# Altium project LM-008.PrjPcb
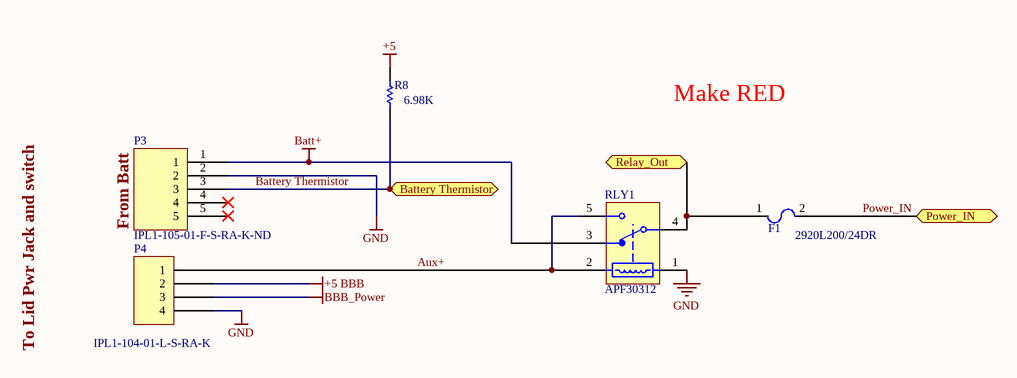
[diagram p0: Power_Input.SchDoc]
3 sheets, 43 parts. Net scope: flat (ports and power ports of the same name join across sheets).
Board file: LM-008.PcbDoc
Sheets:
  Power_Input.SchDoc
  36V_Supply.SchDoc
  LM-008.SchDoc

## Sheet Power_Input.SchDoc: Power Input
size OrCAD A; DocumentNumber: LM-008; Revision: A; SheetNumber: 1; SheetTotal: 2; DocumentName: LM-008

### Parts
F1  PCT  [CAPC7451X12N]  (value not drawn)
P3  Supplier Part Number 1: IPL1-105-01-F-S-RA-K-ND  [IPL1-105-01-F-S-RA]  (hidden comment: IPL1-105-01-F-S-RA)
P4  IPL1-104-01-L-S-RA-K  [IPL1-104-01-L-S-RA-K]
R8  6.98K  [RESC0402(1005)_L]
RLY1  APF30312  [PNSC-PF-5-2800x500x1500_V]

### Ports
Battery Thermistor, Power_IN, Relay_Out

### Nets
+5: R8.2
+5 BBB: P4.2
Batt+: P3.1 RLY1.3(NC)
BBB_Power: P4.3
GND: P3.2 P4.4 RLY1.1
Aux+: P4.1 RLY1.2 RLY1.5(NO)
Battery Thermistor: P3.3 R8.1 ; port Battery Thermistor
Power_IN: F1.2 ; port Power_IN
NetF1_1: F1.1 RLY1.4(COM) ; port Relay_Out

Not connected (* = marked no-connect by the designer): P3 4* 5*

### Notes on the sheet
- Make RED
- From Batt
- (near F1) 2920L200/24DR
- To Lid Pwr Jack and switch
- Title
- Size:
- Date:
- Orcad A
- Number:
- Time:
- Revision:
- Sheet
- of
- ZLS Corporation
- 7801 North Lamar Blvd.
- Suite E-184
- Austin, Texas 78752  USA
- (512) 453-0288
- File:

### Library data of the parts
P4 = IPL1-104-01-L-S-RA-K: Manufacturer: Samtec Inc.; Connector Type: Header; Pitch - Mating: 0.100" (2.54mm); Number of Positions: 4; Number of Positions Loaded: All; Style: Board to Cable/Wire; Shrouding: Shrouded - 4 Wall; Contact Length - Mating: 0.215" (5.46mm); Contact Length - Post: 0.085" (2.16mm); Material Flammability Rating: UL94 V-0; Voltage Rating: 675VAC, 954VDC; Supplier 1: Digi-Key; Supplier Part Number 1: SAM9597-ND; Manufacturer Part Number: IPL1-104-01-L-S-RA-K; RoHS: RoHS Compliant; Category: Connectors, Interconnects; Stock 1: 265; Pricing 1: 1=2.53, 10=2.424, 100=2.02, 500=1.717, 1000=1.4645, 5000=1.313 (USD); Packaging: Tube; Part Status: Active; Contact Type: Male Pin; Number of Rows: 1; Row Spacing - Mating: -; Mounting Type: Through Hole, Right Angle; Termination: Solder; Fastening Type: Locking Ramp; Overall Contact Length: -; Insulation Height: 0.240" (6.10mm); Contact Shape: Square; Contact Finish - Mating: Gold; Contact Finish Thickness - Mating: 10µin (0.25µm); Contact Finish - Post: Tin; Contact Material: Phosphor Bronze; Insulation Material: Liquid Crystal Polymer (LCP); Features: -; Operating Temperature: -55°C ~ 125°C; Ingress Protection: -; Insulation Color: Natural; Current Rating: -; Mated Stacking Heights: -; Contact Finish Thickness - Post: -; Applications: -; ComponentLink1URL: http://suddendocs.samtec.com/prints/ipl1-1xx-xx-xxx-s-xx-x-xx-mkt.pdf; ComponentLink1Description: http://suddendocs.samtec.com/prints/ipl1-1xx-xx-xxx-s-xx-x-xx-mkt.pdf
R8 = CMP-1011-00927-1: RES SMD 6.98K OHM 1% 1/16W 0402; Manufacturer: Yageo; Manufacturer Part Number: RC0402FR-076K98L; Power (Watts): 0.063W, 1/16W; Temperature Coefficient: ±100ppm/°C; Supplier 1: Digi-Key; Supplier Part Number 1: YAG3220CT-ND; RoHS: RoHS Compliant; Category: Resistors; Stock 1: 182255; Pricing 1: 1=0.1, 10=0.014, 100=0.0055, 1000=0.00247, 2500=0.00214, 5000=0.00177 (USD); Packaging: Cut Tape (CT); Part Status: Active; Tolerance: ±1%; Composition: Thick Film; Features: Moisture Resistant; Operating Temperature: -55°C ~ 155°C; Package / Case: 0402 (1005 Metric); Supplier Device Package: 0402; Size / Dimension: 0.039" L x 0.020" W (1.00mm x 0.50mm); Height - Seated (Max): 0.016" (0.40mm); Failure Rate: -; ComponentLink1URL: http://www.yageo.com/documents/recent/PYu-RC_Group_51_RoHS_L_7.pdf; ComponentLink1Description: http://www.yageo.com/documents/recent/PYu-RC_Group_51_RoHS_L_7.pdf
RLY1 = CMP-1503-00270-1: PF Relays, 12 V Coil Voltage, 170 mW Nominal Operating Power, -40 to 85 degC, 5-Pin PF, Tube, Case, RoHS; Manufacturer: Panasonic; Max Switching Voltage: 250 V AC; Nominal Operating Power: 170 mW; Electrical Life: 5x10^4 (N.O.), 3x10^4 (N.C.); Max Switching Current: 6 A; Coil Voltage: 12 V; Mechanical Life(Min.operation): 5x10^6; Pb-Free: True; ComponentLink3Description: Package Specification; ComponentLink1Description: Manufacturer URL; RoHS: True; ComponentLink3URL: http://www3.panasonic.biz/ac/e_download/control/relay/power/catalog/mech_eng_pf.pdf?f_cd=300412; PackageReference: PF-5-2800x500x1500; ComponentLink1URL: http://www3.panasonic.biz/ac/ae/index.jsp; ComponentLink2Description: Datasheet; Series: PF Relays; PartNumber: APF30312; PackageDescription: 5-Pin Through Hole Terminal Package, Body 28 x 5 mm; Packing: Tube, Case; DatasheetVersion: 201402-T; Mounting Technology: Through Hole; PackageVersion: ASCTB205E, 02/2014; ComponentLink2URL: http://www3.panasonic.biz/ac/e_download/control/relay/power/catalog/mech_eng_pf.pdf?f_cd=300412
P3 = IPL1-105-01-F-S-RA: Supplier 1: Digi-Key

## Sheet 36V_Supply.SchDoc: 36V DC-DC Converter
size OrCAD A; DocumentNumber: LM-008; Revision: -; SheetNumber: 2; SheetTotal: 3; DocumentName: LM-008
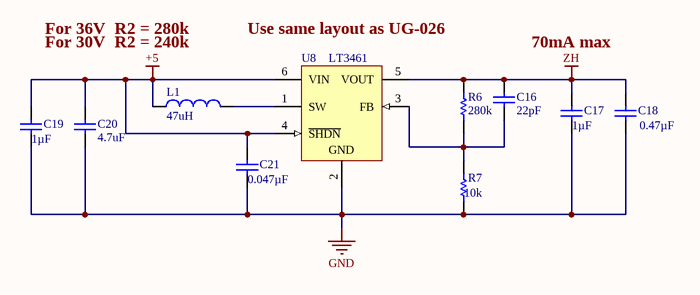
[diagram p1: 36V_Supply.SchDoc]

### Parts
C16  22pF  [CAPC1206(3216)170_L]
C17  Capacitance: 1µF  [CAPC1210(3225)100_N]  (hidden comment: CAP CER 1UF 50V X7R 1210)
C18  Capacitance: 0.47µF  [CAPC1206(3216)190_N]  (hidden comment: CAP CER 0.47UF 50V X7R 1206)
C19  Capacitance: 1µF  [CAPC0805(2012)145_N]  (hidden comment: CAP CER 1UF 16V X7R 0805)
C20  4.7uF  [CAPC0805(2012)145_M]
C21  Capacitance: 0.047µF  [CAPC0805(2012)145_N]  (hidden comment: CAP CER 0.047UF 16V X7R 0603)
L1  47uH  [C1210]
R6  Resistance (Ohms): 280k  [RESC0805(2012)_M]  (hidden comment: RES SMD 280K OHM 1% 1/8W 0805)
R7  Resistance (Ohms): 10k  [RESC0805(2012)_M]  (hidden comment: RES SMD 10K OHM 1% 1/8W 0805)
U8  LT3461  [LT-S6-6-TSOT-23_N]

### Nets
+5: C19.2 C20.2 C21.2 L1.1 U8.4(~{SHDN}) U8.6(VIN)
GND: C17.1 C18.1 C19.1 C20.1 C21.1 R7.2 U8.2(GND)
ZH: C16.2 C17.2 C18.2 R6.1 U8.5(VOUT)
NetC16_1: C16.1 R6.2 R7.1 U8.3(FB)
NetL1_2: L1.2 U8.1(SW)

### Notes on the sheet
- For 36V  R2 = 280k
- For 30V  R2 = 240k
- Use same layout as UG-026
- 70mA max
- Title
- Size:
- Date:
- Orcad A
- Number:
- Time:
- Revision:
- Sheet
- of
- ZLS Corporation
- 7801 North Lamar Blvd.
- Suite E-184
- Austin, Texas 78752  USA
- (512) 453-0288
- File:

### Library data of the parts
C16 = CMP-1037-04573-1: CAP CER 22PF 50V C0G/NP0 1206; Manufacturer: KEMET; Manufacturer Part Number: C1206C220K5GACTU; Tolerance: ±10%; Temperature Coefficient: C0G, NP0; Supplier 1: Digi-Key; Supplier Part Number 1: 399-8165-1-ND; RoHS: RoHS Compliant; Category: Capacitors; Stock 1: 35613; Pricing 1: 1=0.18, 10=0.128, 100=0.06, 500=0.04208, 1000=0.03483 (USD); Packaging: Cut Tape (CT); Part Status: Active; Voltage - Rated: 50V; Operating Temperature: -55°C ~ 125°C; Features: Low ESL; Ratings: -; Applications: General Purpose; Failure Rate: -; Mounting Type: Surface Mount, MLCC; Package / Case: 1206 (3216 Metric); Size / Dimension: 0.126" L x 0.063" W (3.20mm x 1.60mm); Height - Seated (Max): -; Thickness (Max): 0.035" (0.88mm); Lead Spacing: -; Lead Style: -; ComponentLink1URL: http://www.kemet.com/docfinder?Partnumber=C1206C220K2GACTU; ComponentLink1Description: http://www.kemet.com/docfinder?Partnumber=C1206C220K2GACTU
C17 = CMP-1038-01123-1: Manufacturer: Taiyo Yuden; Manufacturer Part Number: UMK325B7105KH-T; Tolerance: ±10%; Supplier 1: Digi-Key; Supplier Part Number 1: 587-1366-1-ND; RoHS: RoHS Compliant; Category: Capacitors; Stock 1: 23864; Pricing 1: 1=0.36, 10=0.247, 100=0.1398, 500=0.0987, 1000=0.08637 (USD); Packaging: Cut Tape (CT); Part Status: Active; Voltage - Rated: 50V; Temperature Coefficient: X7R; Operating Temperature: -55°C ~ 125°C; Features: -; Ratings: -; Applications: General Purpose; Mounting Type: Surface Mount, MLCC; Package / Case: 1210 (3225 Metric); Size / Dimension: 0.126" L x 0.098" W (3.20mm x 2.50mm); Height - Seated (Max): -; Thickness (Max): 0.063" (1.60mm); Lead Spacing: -; Lead Style: -; ComponentLink1URL: http://www.yuden.co.jp/productdata/catalog/en/mlcc_all_e.pdf; ComponentLink1Description: http://www.yuden.co.jp/productdata/catalog/en/mlcc_all_e.pdf
C18 = CMP-1037-04570-1: Manufacturer: Taiyo Yuden; Manufacturer Part Number: UMK316B7474KL-T; Tolerance: ±10%; Supplier 1: Digi-Key; Supplier Part Number 1: 587-1325-1-ND; RoHS: RoHS Compliant; Category: Capacitors; Stock 1: 8658; Pricing 1: 1=0.3, 10=0.203, 100=0.115, 500=0.08114, 1000=0.071 (USD); Packaging: Cut Tape (CT); Part Status: Active; Voltage - Rated: 50V; Temperature Coefficient: X7R; Operating Temperature: -55°C ~ 125°C; Features: -; Ratings: -; Applications: General Purpose; Mounting Type: Surface Mount, MLCC; Package / Case: 1206 (3216 Metric); Size / Dimension: 0.126" L x 0.063" W (3.20mm x 1.60mm); Height - Seated (Max): -; Thickness (Max): 0.071" (1.80mm); Lead Spacing: -; Lead Style: -; ComponentLink1URL: http://www.yuden.co.jp/productdata/catalog/en/mlcc_all_e.pdf; ComponentLink1Description: http://www.yuden.co.jp/productdata/catalog/en/mlcc_all_e.pdf
C19 = CMP-1036-04795-1: Manufacturer: Taiyo Yuden; Manufacturer Part Number: EMK212B7105KG-T; Tolerance: ±10%; Supplier 1: Digi-Key; Supplier Part Number 1: 587-1283-1-ND; RoHS: RoHS Compliant; Category: Capacitors; Stock 1: 41495; Pricing 1: 1=0.13, 10=0.089, 100=0.042, 1000=0.02439 (USD); Packaging: Cut Tape (CT); Part Status: Active; Voltage - Rated: 16V; Temperature Coefficient: X7R; Operating Temperature: -55°C ~ 125°C; Features: -; Ratings: -; Applications: General Purpose; Mounting Type: Surface Mount, MLCC; Package / Case: 0805 (2012 Metric); Size / Dimension: 0.079" L x 0.049" W (2.00mm x 1.25mm); Height - Seated (Max): -; Thickness (Max): 0.053" (1.35mm); Lead Spacing: -; Lead Style: -; ComponentLink1URL: http://ds.yuden.co.jp/TYCOMPAS/ut/detail.do?productNo=EMK212B7105KG-T&fileName=EMK212B7105KG-T_SS&mode=specSheetDownload; ComponentLink1Description: http://ds.yuden.co.jp/TYCOMPAS/ut/detail.do?productNo=EMK212B7105KG-T&fileName=EMK212B7105KG-T_SS&mode=specSheetDownload
C20 = CMP-1036-04750-1: CAP CER 4.7UF 16V X7R 0805; Manufacturer: KEMET; Manufacturer Part Number: C0805C475K4RACTU; Tolerance: ±10%; Supplier 1: Digi-Key; Supplier Part Number 1: 399-7415-1-ND; RoHS: RoHS Compliant; Category: Capacitors; Stock 1: 88820; Pricing 1: 1=0.26, 10=0.176, 100=0.0894, 500=0.06118, 1000=0.05412 (USD); Packaging: Cut Tape (CT); Part Status: Active; Voltage - Rated: 16V; Temperature Coefficient: X7R; Operating Temperature: -55°C ~ 125°C; Features: Low ESL; Ratings: -; Applications: General Purpose; Failure Rate: -; Mounting Type: Surface Mount, MLCC; Package / Case: 0805 (2012 Metric); Size / Dimension: 0.079" L x 0.049" W (2.00mm x 1.25mm); Height - Seated (Max): -; Thickness (Max): 0.055" (1.40mm); Lead Spacing: -; Lead Style: -; ComponentLink1URL: http://www.kemet.com/docfinder?Partnumber=C0805C475K4RACTU; ComponentLink1Description: http://www.kemet.com/docfinder?Partnumber=C0805C475K4RACTU
C21 = CMP-1036-04795-1: Manufacturer: Murata Electronics North America; Manufacturer Part Number: GRM188R71C473KA01D; Tolerance: ±10%; Supplier 1: Digi-Key; Supplier Part Number 1: 490-1529-6-ND; RoHS: RoHS Compliant; Category: Capacitors; Stock 1: 26; Pricing 1: 1=0.1, 10=0.046, 100=0.0206, 500=0.0147, 1000=0.01155 (USD); Packaging: Digi-Reel®; Part Status: Active; Voltage - Rated: 16V; Temperature Coefficient: X7R; Operating Temperature: -55°C ~ 125°C; Features: -; Ratings: -; Applications: General Purpose; Mounting Type: Surface Mount, MLCC; Package / Case: 0603 (1608 Metric); Size / Dimension: 0.063" L x 0.031" W (1.60mm x 0.80mm); Height - Seated (Max): -; Thickness (Max): 0.035" (0.90mm); Lead Spacing: -; Lead Style: -; ComponentLink1URL: http://www.murata.com/~/media/webrenewal/support/library/catalog/products/capacitor/mlcc/c02e.ashx; ComponentLink1Description: http://www.murata.com/~/media/webrenewal/support/library/catalog/products/capacitor/mlcc/c02e.ashx
L1 = Inductor: FIXED IND 47UH 170MA 1.3 OHM SMD; Manufacturer: Murata Electronics North America; Manufacturer Part Number: LQH32CN470K23L; Type: Wirewound; Material - Core: Ferrite; Tolerance: ±10%; Shielding: Unshielded; DC Resistance (DCR): 1.69 Ohm Max; Supplier 1: Digi-Key; Supplier Part Number 1: 490-2497-1-ND; RoHS: RoHS Compliant; Category: Inductors, Coils, Chokes; Stock 1: 1058; Pricing 1: 1=0.33, 10=0.297, 100=0.2043, 500=0.17458, 1000=0.13372 (USD); Packaging: Cut Tape (CT); Part Status: Active; Q @ Freq: -; Ratings: -; Operating Temperature: -40°C ~ 85°C; Mounting Type: Surface Mount; Package / Case: Nonstandard; Supplier Device Package: 1210; Size / Dimension: 0.126" L x 0.098" W (3.20mm x 2.50mm); Height - Seated (Max): 0.067" (1.70mm); ComponentLink1URL: http://search.murata.co.jp/Ceramy/image/img/P02/JELF243A-0039.pdf; ComponentLink1Description: http://search.murata.co.jp/Ceramy/image/img/P02/JELF243A-0039.pdf
R6 = CMP-1013-00017-1: Manufacturer: Vishay Dale; Manufacturer Part Number: CRCW0805280KFKEA; Power (Watts): 0.125W, 1/8W; Temperature Coefficient: ±100ppm/°C; Supplier 1: Digi-Key; Supplier Part Number 1: 541-280KCTR-ND; RoHS: RoHS Compliant; Category: Resistors; Stock 1: 10000; Pricing 1: 5000=0.00546, 10000=0.00474, 25000=0.00417, 50000=0.00382, 125000=0.00375 (USD); Packaging: Tape & Reel (TR); Part Status: Active; Tolerance: ±1%; Composition: Thick Film; Features: Automotive AEC-Q200; Operating Temperature: -55°C ~ 155°C; Package / Case: 0805 (2012 Metric); Supplier Device Package: 0805; Size / Dimension: 0.079" L x 0.049" W (2.00mm x 1.25mm); Height - Seated (Max): 0.020" (0.50mm); Failure Rate: -; ComponentLink1URL: http://www.vishay.com/docs/20035/dcrcwe3.pdf; ComponentLink1Description: http://www.vishay.com/docs/20035/dcrcwe3.pdf
R7 = CMP-1013-00017-1: Manufacturer: Yageo; Manufacturer Part Number: RC0805FR-0710KL; Power (Watts): 0.125W, 1/8W; Temperature Coefficient: ±100ppm/°C; Supplier 1: Digi-Key; Supplier Part Number 1: 311-10.0KCRCT-ND; RoHS: RoHS Compliant; Category: Resistors; Stock 1: 13336570; Pricing 1: 1=0.1, 10=0.022, 100=0.0088, 1000=0.00396, 2500=0.00344 (USD); Packaging: Cut Tape (CT); Part Status: Active; Tolerance: ±1%; Composition: Thick Film; Features: Moisture Resistant; Operating Temperature: -55°C ~ 155°C; Package / Case: 0805 (2012 Metric); Supplier Device Package: 0805; Size / Dimension: 0.079" L x 0.049" W (2.00mm x 1.25mm); Height - Seated (Max): 0.024" (0.60mm); Failure Rate: -; ComponentLink1URL: http://www.yageo.com/documents/recent/PYu-RC_Group_51_RoHS_L_7.pdf; ComponentLink1Description: http://www.yageo.com/documents/recent/PYu-RC_Group_51_RoHS_L_7.pdf
U8 = CMP-0491-01698-1: IC REG BOOST ADJ 0.3A TSOT23-6; Manufacturer 1: Linear Technology; Manufacturer Part Number 1: LT3461AES6#TRMPBF; Category 1: Integrated Circuits (ICs); Function: Step-Up; Output Configuration: Positive; Output Type: Adjustable; Number of Outputs: 1; Voltage - Input (Min): 2.5V; Voltage - Input (Max): 16V; Voltage - Output (Min/Fixed): 1.255V; Voltage - Output (Max): 38V; Current - Output: 300mA (Switch); Frequency - Switching: 3MHz; Synchronous Rectifier: No; Supplier 1: Digi-Key; Supplier Part Number 1: LT3461AES6#TRMPBFCT-ND; RoHS 1: RoHS Compliant; Description 1: IC REG BOOST ADJ 0.3A TSOT23-6; Stock 1: 1325; Pricing 1: 1=3.94, 25=3.52, 100=2.4, 250=2.2 (USD); Packaging: Cut Tape (CT); Part Status: Active; Topology: Boost; Operating Temperature: 0°C ~ 70°C (TA); Mounting Type: Surface Mount; Package / Case: SOT-23-6 Thin, TSOT-23-6; Supplier Device Package: TSOT-23-6; ComponentLink1URL: http://www.linear.com/docs/3469; ComponentLink1Description: http://www.linear.com/docs/3469

## Sheet LM-008.SchDoc: Main
size Tabloid; DocumentNumber: LM-008; SheetNumber: 3; SheetTotal: 3; DocumentName: LM-008
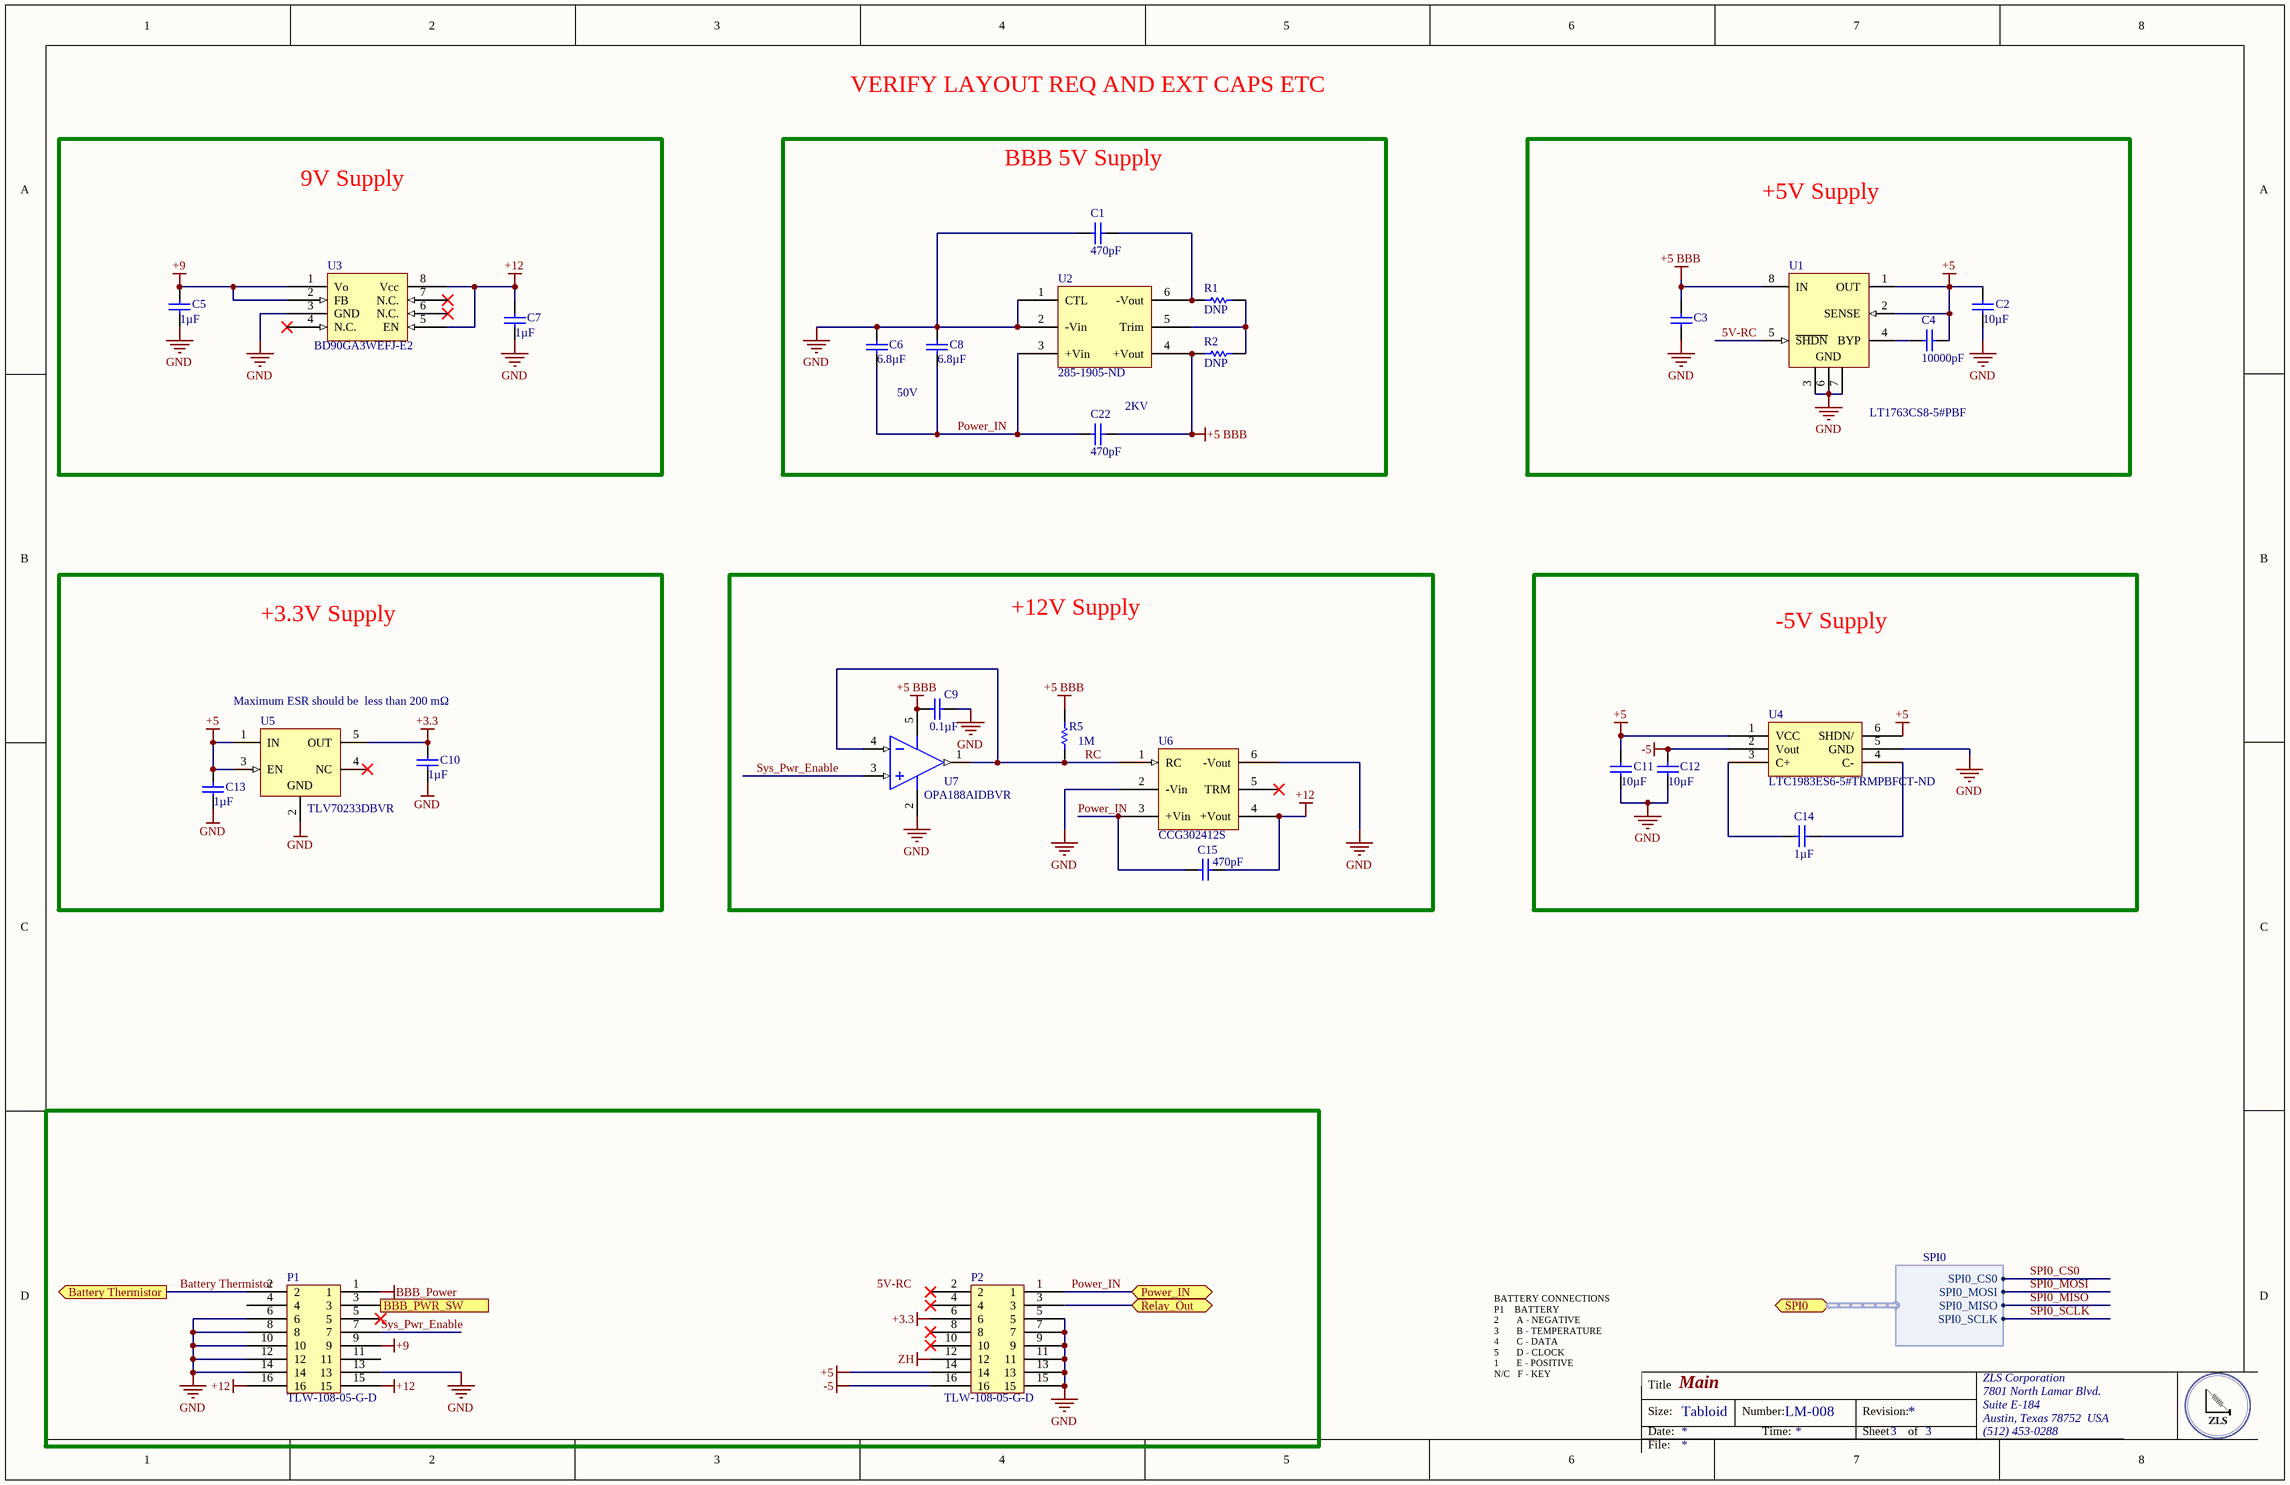
[diagram p2: LM-008.SchDoc]

### Parts
C1  Capacitance: 470pF  [CAPC1206(3216)130_N]  (hidden comment: CAP CER 1UF 50V X7R 1210)
C2  Capacitance: 10µF  [CAPC1206(3216)130_N]  (hidden comment: CAP CER 1UF 50V X7R 1210)
C3  1uF  [CAPC1206(3216)130_N]  (value not drawn)
C4  Capacitance: 10000pF  [CAPC1206(3216)130_N]  (hidden comment: CAP CER 1UF 50V X7R 1210)
C5  Capacitance: 1µF  [CAPC1206(3216)130_N]  (hidden comment: CAP CER 1UF 50V X7R 1210)
C6  Capacitance: 6.8µF  [CAPC1206(3216)130_N]  (hidden comment: CAP CER 1UF 50V X7R 1210)
C7  Capacitance: 1µF  [CAPC1206(3216)130_N]  (hidden comment: CAP CER 1UF 50V X7R 1210)
C8  Capacitance: 6.8µF  [CAPC1206(3216)130_N]  (hidden comment: CAP CER 1UF 50V X7R 1210)
C9  Capacitance: 0.1µF  [CAPC0805(2012)145_N]  (hidden comment: CAP CER 0.1UF 16V X7R 0805)
C10  Capacitance: 1µF  [CAPC1206(3216)130_N]  (hidden comment: CAP CER 1UF 50V X7R 1210)
C11  Capacitance: 10µF  [CAPC1206(3216)130_N]  (hidden comment: CAP CER 1UF 50V X7R 1210)
C12  Capacitance: 10µF  [CAPC1206(3216)130_N]  (hidden comment: CAP CER 1UF 50V X7R 1210)
C13  Capacitance: 1µF  [CAPC1206(3216)130_N]  (hidden comment: CAP CER 1UF 50V X7R 1210)
C14  Capacitance: 1µF  [CAPC1206(3216)130_N]  (hidden comment: CAP CER 1UF 50V X7R 1210)
C15  Capacitance: 470pF  [CAPC1812(4532)230_M]  (hidden comment: CAP CER 470PF 3KV X7R 1812)
C22  Capacitance: 470pF  [CAPC1206(3216)130_N]  (hidden comment: CAP CER 1UF 50V X7R 1210)
P1  TLW-108-05-G-D  [TLW-108-05-G-D]
P2  TLW-108-05-G-D  [TLW-108-05-G-D]
R1  DNP  [RESC0402(1005)_L]
R2  DNP  [RESC0402(1005)_L]
R5  1M  [RESC0402(1005)_L]
U1  LT1763CS8-5#PBF  [LT-S8-8_M]
U2  Supplier Part Number 1: 285-1905-ND  [PXB15-24WS05/NT]  (hidden comment: PXB15-24WS05/NT)
U3  BD90GA3WEFJ-E2  [TSOP127P600X100-8N]
U4  Supplier Part Number 1: LTC1983ES6-5#TRMPBFCT-ND  [SOT95P323X100-6N]  (hidden comment: LTC1983ES6-5#TRMPBF)
U5  TLV70233DBVR  [DBV0005A_N]
U6  CCG302412S  [CCG30]
U7  OPA188AIDBVR  [DBV0005A_M]

### Blocks framed on the sheet
9V Supply: C5 C7 U3
BBB 5V Supply: C1 C6 C8 C22 R1 R2 U2
+5V Supply: C2-C4 U1
+3.3V Supply: C10 C13 U5
+12V Supply: C9 C15 R5 U6 U7
-5V Supply: C11 C12 C14 U4

### Ports
Battery Thermistor (out), BBB_PWR_SW, Power_IN, Relay_Out, SPI0 (harness SPI0)

### Harnesses
SPI0: SPI0_CS0, SPI0_MOSI, SPI0_MISO, SPI0_SCLK

### Nets
+3.3: C10.2 P2.6 U5.5(OUT)
+5: C2.2 C4.1 C11.2 C13.2 P2.14 U1.1(OUT) U1.2(SENSE) U4.1(VCC) U4.6(SHDN/) U5.1(IN) U5.3(EN)
+5 BBB: C3.2 C9.1 C22.1 R2.2 R5.2 U1.8(IN) U2.4(+Vout) U7.5(V+)
+9: C5.2 P1.9 U3.1(Vo) U3.2(FB)
+12: C7.2 C15.2 P1.15 P1.16 U3.5(EN) U3.8(Vcc) U6.4(+Vout)
-5: C12.2 P2.16 U4.2(Vout)
BBB_Power: P1.1
GND: C1.2 C2.1 C3.1 C5.1 C6.2 C7.1 C8.2 C9.2 C10.1 C11.1 C12.1 C13.1 P1.6 P1.8 P1.10 P1.12 P1.13 P1.14 P2.5 P2.7 P2.9 P2.11 P2.13 P2.15 U1.3(GND) U1.6(GND) U1.7(GND) U2.1(CTL) U2.2(-Vin) U3.3(GND) U4.5(GND) U5.2(GND) U6.2(-Vin) U6.6(-Vout) U7.2(V-)
ZH: P2.12
5V-RC: U1.5(~{SHDN})
Battery Thermistor: P1.2 ; port Battery Thermistor
Power_IN: C6.1 C8.1 C15.1 C22.2 P2.1 U2.3(+Vin) U6.3(+Vin) ; port Power_IN
RC: R5.1 U6.1(RC) U7.1(OUT) U7.4(IN-)
SPI0_CS0: port SPI0.SPI0_CS0
SPI0_MISO: port SPI0.SPI0_MISO
SPI0_MOSI: port SPI0.SPI0_MOSI
SPI0_SCLK: port SPI0.SPI0_SCLK
Sys_Pwr_Enable: P1.7 U7.3(IN+)
NetC1_1: C1.1 R1.2 U2.6(-Vout)
NetC4_2: C4.2 U1.4(BYP)
NetC14_1: C14.1 U4.4(C-)
NetC14_2: C14.2 U4.3(C+)
NetF1_1: P2.3 ; port Relay_Out
NetP1_3: P1.3 ; port BBB_PWR_SW
NetR1_1: R1.1 R2.1 U2.5(Trim)

Not connected (* = marked no-connect by the designer): P1 4 5* 11; P2 2* 4* 8* 10*; U3 4(N.C.)* 6(N.C.)* 7(N.C.)*; U5 4(NC)*; U6 5(TRM)*

### Notes on the sheet
- VERIFY LAYOUT REQ AND EXT CAPS ETC
- 50V
- (near C22) 2KV
- Maximum ESR should be  less than 200 mΩ
- BATTERY CONNECTIONS
  P1    BATTERY
  2       A - NEGATIVE
  3       B - TEMPERATURE
  4       C - DATA
  5       D - CLOCK
  1       E - POSITIVE
  N/C   F - KEY
- Labels drawn without touching a wire or pin: 5V-RC
- Title
- Size:
- Date:
- Tabloid
- Number:
- Time:
- Revision:
- Sheet
- of
- ZLS Corporation
- 7801 North Lamar Blvd.
- Suite E-184
- Austin, Texas 78752  USA
- (512) 453-0288
- File:

### Library data of the parts
C1 C2 C4-C8 C10-C14 C22 = CMP-1037-04913-1: Manufacturer: Murata Electronics North America; Manufacturer Part Number: GRM32RR71H105KA01L; Tolerance: ±10%; Supplier 1: Digi-Key; Supplier Part Number 1: 490-1863-6-ND; RoHS: RoHS Compliant; Category: Capacitors; Stock 1: 66890; Pricing 1: 1=0.35, 10=0.242, 100=0.1449, 500=0.10868 (USD); Packaging: Digi-Reel®; Part Status: Active; Voltage - Rated: 50V; Temperature Coefficient: X7R; Operating Temperature: -55°C ~ 125°C; Features: -; Ratings: -; Applications: General Purpose; Mounting Type: Surface Mount, MLCC; Package / Case: 1210 (3225 Metric); Size / Dimension: 0.126" L x 0.098" W (3.20mm x 2.50mm); Height - Seated (Max): -; Thickness (Max): 0.079" (2.00mm); Lead Spacing: -; Lead Style: -; ComponentLink1URL: http://search.murata.co.jp/Ceramy/image/img/A01X/G101/ENG/GRM32RR71H105KA01-01.pdf; ComponentLink1Description: http://search.murata.co.jp/Ceramy/image/img/A01X/G101/ENG/GRM32RR71H105KA01-01.pdf
C3 = CMP-1037-04913-1
C9 = CMP-1036-04795-1: Manufacturer: Murata Electronics North America; Manufacturer Part Number: GRM219R71C104KA01D; Tolerance: ±10%; Voltage - Rated: 25V; Supplier Part Number 1: 490-1673-6-ND; Temperature Coefficient: X7R; Thickness (Max): 0.053" (1.35mm); Supplier 2: Digi-Key; Supplier Part Number 2: 490-1683-6-ND; RoHS: RoHS Compliant; Category: Capacitors; Stock 2: 245331; Pricing 2: 1=0.14, 10=0.098, 100=0.0462, 500=0.0324, 1000=0.02683 (USD); Packaging: Digi-Reel®; Part Status: Active; Operating Temperature: -55°C ~ 125°C; Features: -; Ratings: -; Applications: General Purpose; Mounting Type: Surface Mount, MLCC; Package / Case: 0805 (2012 Metric); Size / Dimension: 0.079" L x 0.049" W (2.00mm x 1.25mm); Height - Seated (Max): -; Lead Spacing: -; Lead Style: -; ComponentLink1URL: http://www.murata.com/~/media/webrenewal/support/library/catalog/products/capacitor/mlcc/c02e.ashx; ComponentLink1Description: http://www.murata.com/~/media/webrenewal/support/library/catalog/products/capacitor/mlcc/c02e.ashx
C15 = CMP-1040-00561-1: Manufacturer: Kemet; Manufacturer Part Number: C1812C471KHRACTU; Tolerance: 10%; Supplier 1: Digi-Key; Supplier Part Number 1: 399-7289-6-ND; Stock 1: 2705; Pricing 1: 1=0.88, 10=0.666, 100=0.4761 (USD); Case/Package: 1812; Case Code (Metric): 4532; Case Code (Imperial): 1812; Min Operating Temperature: -55°C; Max Operating Temperature: 125°C; Voltage Rating: 3kV; Packaging: Tape and Reel; Package Quantity: 1; Voltage Rating (DC): 3kV; Length: 0.177inch; Width: 0.126inch; Thickness: 0.071inch; Lead Free: Lead Free; ComponentLink1URL: http://www.kemet.com/docfinder?Partnumber=C1812C471KHRACTU; ComponentLink1Description: http://www.kemet.com/docfinder?Partnumber=C1812C471KHRACTU
P1 P2 = TLW-108-05-G-D: CONN HEADER .100" 16POS DL GOLD; Manufacturer: Samtec Inc.; Pitch - Mating: 0.100" (2.54mm); Number of Positions: 16; Number of Positions Loaded: All; Style: Board to Board or Cable; Shrouding: Unshrouded; Contact Length - Mating: 0.105" (2.67mm); Contact Length - Post: 0.170" (4.32mm); Overall Contact Length: 0.335" (8.51mm); Current Rating: 5.2A per Contact; Supplier 1: Digi-Key; Supplier Part Number 1: SAM1094-08-ND; Manufacturer Part Number: TLW-108-05-G-D; RoHS: RoHS Compliant; Category: Connectors, Interconnects; Stock 1: 0; Pricing 1: 1=4.48, 10=4.006, 100=3.2987, 500=2.60756, 1000=2.23842, 5000=2.04207, 10000=1.96353 (USD); Packaging: Bulk; Part Status: Active; Connector Type: Header; Contact Type: Male Pin; Number of Rows: 2; Row Spacing - Mating: 0.100" (2.54mm); Mounting Type: Through Hole; Termination: Solder; Fastening Type: Push-Pull; Insulation Height: 0.060" (1.52mm); Contact Shape: Square; Contact Finish - Mating: Gold; Contact Finish Thickness - Mating: 10µin (0.25µm); Contact Finish - Post: Gold; Contact Material: Phosphor Bronze; Insulation Material: Liquid Crystal Polymer (LCP); Features: -; Operating Temperature: -55°C ~ 125°C; Ingress Protection: -; Material Flammability Rating: -; Insulation Color: Black; Voltage Rating: -; Mated Stacking Heights: -; Contact Finish Thickness - Post: Flash; Applications: -; ComponentLink1URL: http://suddendocs.samtec.com/prints/tlw-mkt.pdf; ComponentLink1Description: http://suddendocs.samtec.com/prints/tlw-mkt.pdf
R1 R2 = CMP-1011-00927-1: TBD
R5 = CMP-1011-00927-1: Tolerance: ±1%; Temperature Coefficient: ±100ppm/°C; Supplier Part Number 1: YAG3220CT-ND; Supplier Device Package: 0402
U1 = CMP-0476-01685-1: 500 mA, Low Noise, LDO Micropower Regulator, 1.8 to 20 V Vin, 5 V Vout, 8-pin SOIC (S8-8), -40 to 125 degC, Pb-Free; Manufacturer: Linear Technology; Output Voltage: 5 V; Vin Min(V): 1.8; Discrete Pass Element: no; Number of Outputs: 1; Dropout Voltage(V): 0.3; Vin Max(V): 20; PSRR(dB): 65; Iout(mA): 500; Isupply(mA): 0.03; Mounting Technology: Surface Mount; ComponentLink3Description: Package Specification; PartNumber: LT1763CS8-5#PBF; PackageDescription: 8-Pin Plastic Small Outline (Narrow .150 Inch), Body 4.9 x 3.9 mm, Pitch 1.27 mm; DatasheetVersion: Rev. G; ComponentLink2URL: http://cds.linear.com/docs/en/datasheet/1763fg.pdf; PackageReference: S8-8; ComponentLink1URL: http://www.linear.com/; ComponentLink2Description: Datasheet; ComponentLink1Description: Manufacturer URL; PackageVersion: Rev. G, 03/2012; Shutdown Current(uA): 1; ComponentLink3URL: http://cds.linear.com/docs/en/packaging/05081610_G_SO8.pdf; RoHS: TRUE; Noise(uV): 20
U3 = BD90GA3WEFJ-E2: IC REG LDO 9V 0.3A 8HTSOP-J; Manufacturer: Rohm Semiconductor; Regulator Topology: Positive Fixed; Current - Output: 300mA; Voltage - Dropout (Typical): 0.6V @ 300mA; Voltage - Input: Up to 14V; Supplier 1: Digi-Key; Supplier Part Number 1: BD90GA3WEFJ-E2CT-ND; Manufacturer Part Number: BD90GA3WEFJ-E2; RoHS: RoHS Compliant; Category: Integrated Circuits (ICs); Stock 1: 4781; Pricing 1: 1=0.69, 10=0.606, 25=0.5364, 100=0.4672, 250=0.40664, 500=0.34608, 1000=0.27686 (USD); Packaging: Cut Tape (CT); Part Status: Active; Voltage - Output: 9V; Current - Limit (Min): -; Operating Temperature: -25°C ~ 85°C; Mounting Type: Surface Mount; Package / Case: 8-SOIC (0.154", 3.90mm Width) Exposed Pad; Supplier Device Package: 8-HTSOP-J; ComponentLink1URL: http://rohmfs.rohm.com/en/products/databook/datasheet/ic/power/linear_regulator/bdxxga3wefj-e.pdf; ComponentLink1Description: http://rohmfs.rohm.com/en/products/databook/datasheet/ic/power/linear_regulator/bdxxga3wefj-e.pdf
U4 = LTC1983ES6-5#TRMPBF: Manufacturer: Linear Technology/Analog Devices; Function: Step-Down; Output Configuration: Negative; Topology: Charge Pump; Output Type: Fixed; Number of Outputs: 1; Voltage - Input (Min): 2.3V; Voltage - Input (Max): 5.5V; Voltage - Output (Min/Fixed): -5V; Current - Output: 100mA; Frequency - Switching: 900kHz; Synchronous Rectifier: No; Supplier 1: Digi-Key; Manufacturer Part Number: LTC1983ES6-5#TRMPBF; RoHS: RoHS Compliant; Category: Integrated Circuits (ICs); Stock 1: 17516; Pricing 1: 1=4.36, 25=3.8952, 100=2.3256, 250=2.1318 (USD); Packaging: Cut Tape (CT); Part Status: Active; Voltage - Output (Max): -; Operating Temperature: -40°C ~ 85°C (TA); Mounting Type: Surface Mount; Package / Case: SOT-23-6 Thin, TSOT-23-6; Supplier Device Package: TSOT-23-6; Base Part Number: LTC1983-5; ComponentLink1URL: http://www.linear.com/docs/2135; ComponentLink1Description: http://www.linear.com/docs/2135
U5 = CMP-0394-00528-2: Single Output LDO, 300 mA, Fixed 3.3 V Output, 2 to 5.5 V Input, with Low IQ, 5-pin SOT-23 (DBV), -40 to 125 degC, Green (RoHS & no Sb/Br); Manufacturer: Texas Instruments; Vout Adj(Max)(V): 3.3; Vin(Max)(V): 5.5; SubFamily: Single Channel LDO; Iq(Typ)(mA): 0.03; Iout(Max)(A): 0.3; Vin(Min)(V): 2; Vdo(Typ)(mV): 220; Vout Adj(Min)(V): 3.3; Eco-Plan: Green (RoHS & no Sb/Br); PackageVersion: 4073253-4/K; ComponentLink1Description: Manufacturer URL; DatasheetVersion: SLVSAG6B; ComponentLink2Description: Datasheet; ComponentLink3URL: http://www.ti.com/litv/pdf/mpds018i; ComponentLink2URL: http://www.ti.com/general/docs/lit/getliterature.tsp?genericPartNumber=TLV70233&fileType=pdf; PackageReference: DBV0005A; ComponentLink1URL: http://www.ti.com/; Mounting Technology: Surface Mount; ComponentLink3Description: Package Specification; PackageDescription: 5-Pin Plastic Small Outline, Body 1.60 Ãƒâ€” 2.90 mm, Pitch 0.95 mm; Code_JEDEC: MO-178; Fixed Output Options(V): 3.3; PartNumber: TLV70233DBVR; Accuracy(%): 2
U6 = CCG302412S: DC/DC CONVERTER 12V 2.5A PCB; Power (Watts) - Manufacture Series: 30W; Manufacturer 1: TDK-Lambda Americas Inc; Number of Outputs: 1; Voltage - Input (Min): 9V; Voltage - Input (Max): 36V; Voltage - Isolation: 1.5kV (1500V); Efficiency: 89%; Category 1: Power Supplies - Board Mount; Packaging: Tube; Type: Isolated Module; Voltage - Output 1: 12V; Voltage - Output 2: -; Voltage - Output 3: -; Current - Output (Max): 2.5A; Features: Remote On/Off, OCP; Mounting Type: Through Hole; Package / Case: 6-DIP Module (6 Leads); Size / Dimension: 1.00" L x 1.00" W x 0.39" H (25.4mm x 25.4mm x 9.9mm); Operating Temperature: -40°C ~ 85°C; Power (Watts) - Max: 30W; ComponentLink1URL: http://www.us.tdk-lambda.com/ftp/specs/ccg30.pdf; ComponentLink1Description: http://www.us.tdk-lambda.com/ftp/specs/ccg30.pdf; Supplier 1: Digi-Key; Supplier Part Number 1: 285-2419-ND; Manufacturer Part Number 1: CCG302412S; RoHS 1: RoHS Compliant; Description 1: DC/DC CONVERTER 12V 2.5A PCB; Stock 1: 30; Pricing 1: 1=43.63, 10=42.95 (USD)
U7 = CMP-0809-00005-2: Precision, Low Noise, Rail-to-Rail Output, Zero-Drift Operational Amplifier, 4 to 36 V, -40 to 125 degC, 5-pin SOT23 (DBV5), Green (RoHS & no Sb/Br); Manufacturer: Texas Instruments; Total Supply Voltage(Min)(+5V is 5, +/-5V is 10): 4; Offset Drift(Typ)(uV/C): 0.03; Rating: Catalog; SubFamily: Zero Drift Precision Amplifier; GBW(Typ)(MHz): 2; Slew Rate(Typ)(V/us): 0.8; Number of Channels: 1; CMRR(Min)(dB): 120; Iq per channel(Max)(mA): 0.51; Total Supply Voltage(Max)(+5V is 5, +/-5V is 10): 36; PartNumber: OPA188AIDBVR; ComponentLink2Description: Datasheet; ComponentLink2URL: http://www.ti.com/lit/ds/symlink/opa188.pdf; ComponentLink1Description: Manufacturer URL; Mounting Technology: Surface Mount; Eco-Plan: Green (RoHS & no Sb/Br); ComponentLink1URL: http://www.ti.com/; PackageVersion: 4073253-4/K, 03/2006; DatasheetVersion: SBOS642A; ComponentLink3Description: Package Specification; PackageReference: DBV0005A; ComponentLink3URL: http://www.ti.com/litv/pdf/mpds018i; PackageDescription: 5-Pin Plastic Small Outline, Body 1.6 x 2.9 mm, Pitch 0.95 mm; Code_JEDEC: MO-178
U2 = PXB15-24WS05/NT: Supplier 1: Digi-Key

## Nets that join several sheets
+5: Power_Input (R8.2), 36V_Supply (6 pins), LM-008 (11 pins)
+5 BBB: Power_Input (P4.2), LM-008 (8 pins)
BBB_Power: Power_Input (P4.3), LM-008 (P1.1)
GND: Power_Input (P3.2 P4.4 RLY1.1), 36V_Supply (7 pins), LM-008 (35 pins)
ZH: 36V_Supply (5 pins), LM-008 (P2.12)
Battery Thermistor: Power_Input (P3.3 R8.1), LM-008 (P1.2)
NetF1_1: Power_Input (F1.1 RLY1.4), LM-008 (P2.3)
Power_IN: Power_Input (F1.2), LM-008 (7 pins)